# EAGLE design chuck_rev_2 (EAGLE 6.3)
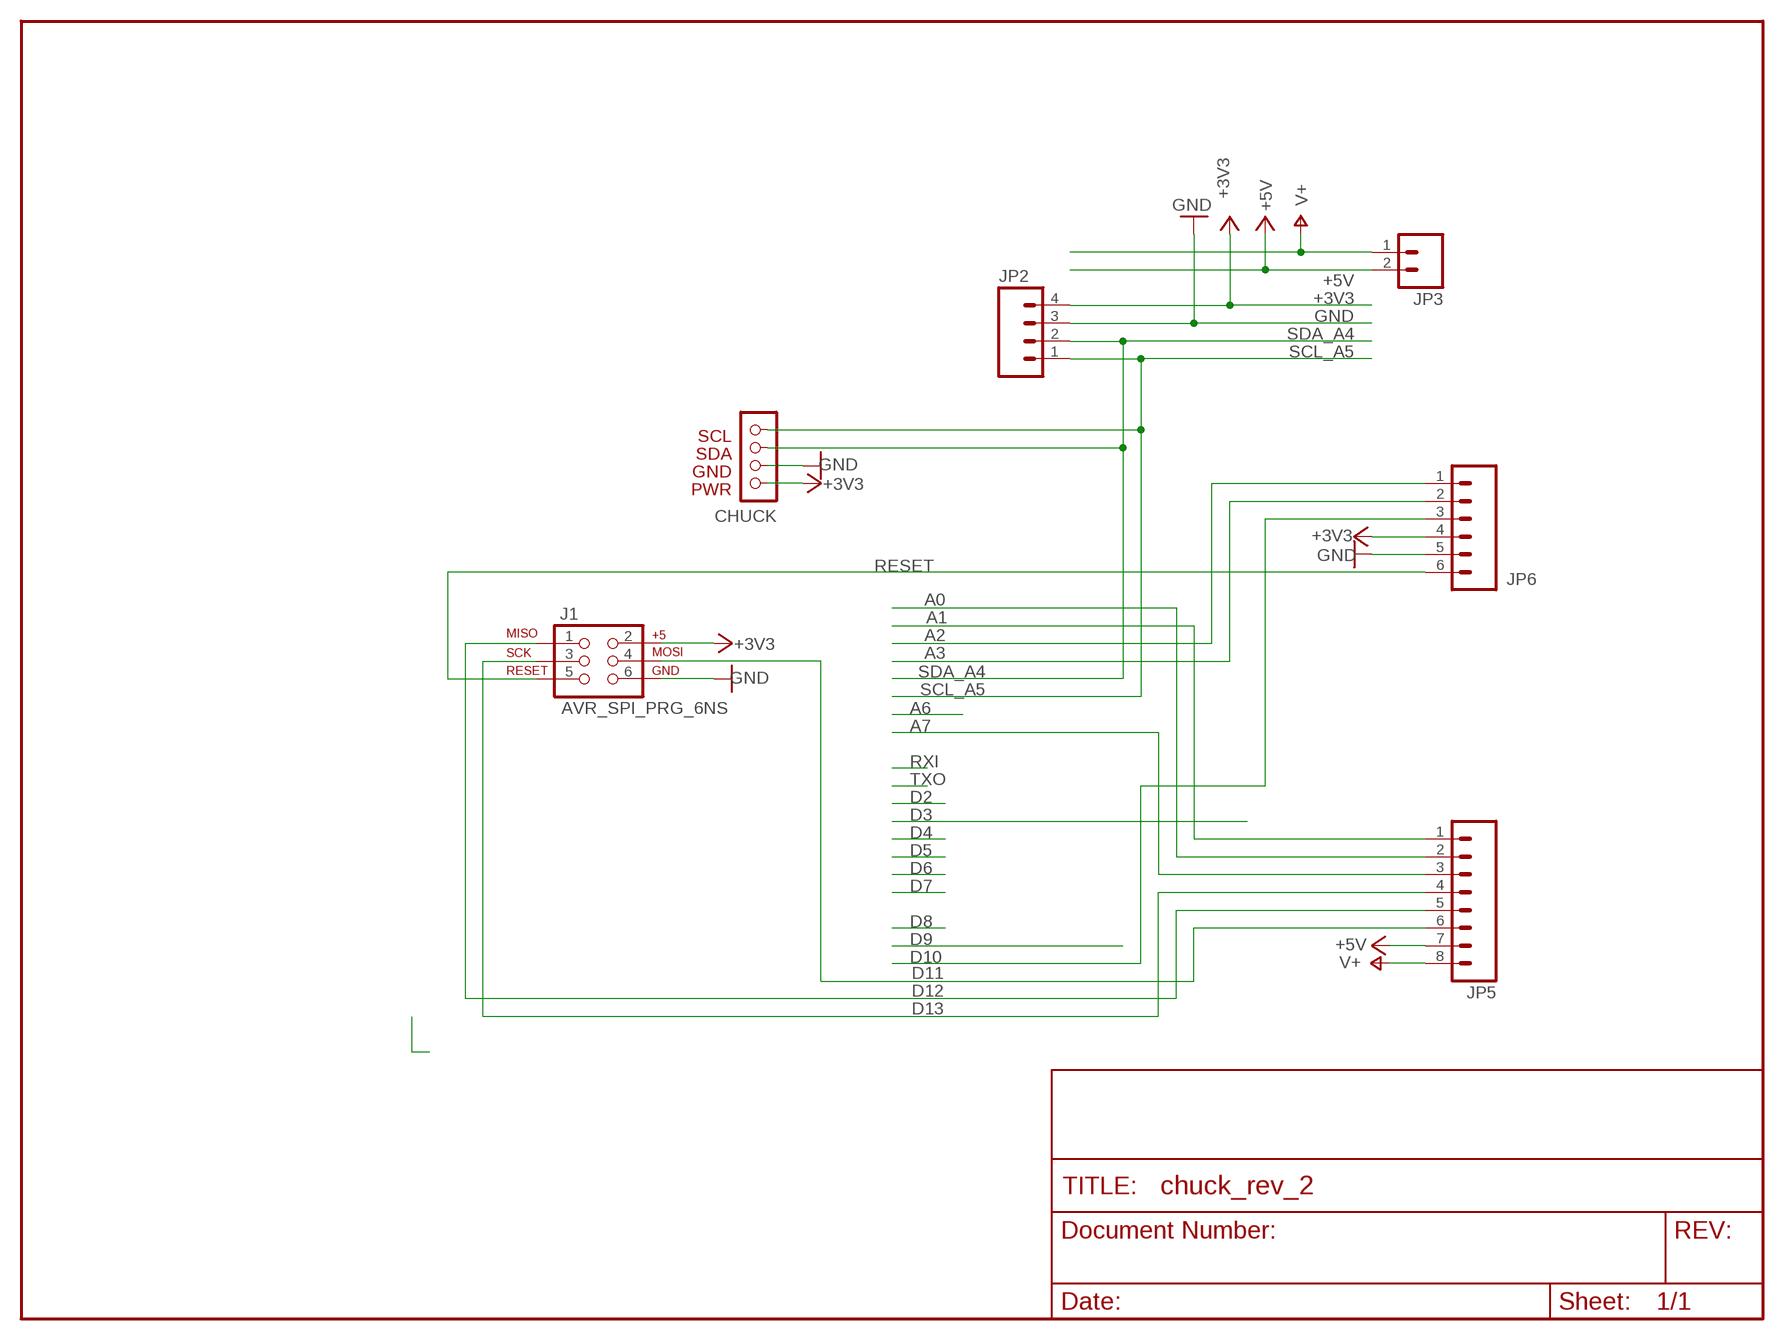
[diagram p0: schematic, sheet 1]

## Parts
CHUCK  NUNCHUCK  [CONN]
J1  AVR_SPI_PRG_6NS  [2X3-NS]
JP2  M04PTH  [1X04]
JP3  M02PTH  [1X02]
JP5  M081X08  [1X08]
JP6  M06SIP  [1X06]

## Nets
+3V3: CHUCK.PWR J1.2 JP2.4 JP6.4
+5V: JP3.2 JP5.7
A0: JP5.2
A1: JP5.1
A2: JP6.1
A3: JP6.2
A7: JP5.3
D10: JP6.3
D11: J1.4 JP5.6
D12: J1.1 JP5.5
D13: J1.3 JP5.4
GND: CHUCK.GND J1.6 JP2.3 JP6.5
RESET: J1.5 JP6.6
SCL_A5: CHUCK.SCL JP2.1
SDA_A4: CHUCK.SDA JP2.2
V+: JP3.1 JP5.8

## Library data of the parts
CHUCK = _my-parts:NUNCHUCK
J1 = SparkFun:AVR_SPI_PRG_6: AVR ISP 6 Pin This is the reduced ISP connector for AVR programming. Common on Arduino. This footprint will take up less PCB space and can be used with a 10-pin to 6-pin adapter such as SKU: BOB-08508
JP2 = SparkFun_mod:M04: Header 4 Standard 4-pin 0.1" header. Use with straight break away headers (SKU : PRT-00116), right angle break away headers (PRT-00553), swiss pins (PRT-00743), machine pins (PRT-00117), and female headers (PRT-00115). Molex polarized connector foot print use with SKU : PRT-08231 with associated crimp pins and housings. 1MM SMD Version SKU: PRT-10208
JP3 = SparkFun_mod:M02: Header 2 Standard 2-pin 0.1" header. Use with straight break away headers (SKU : PRT-00116), right angle break away headers (PRT-00553), swiss pins (PRT-00743), machine pins (PRT-00117), and female headers (PRT-00115). Molex polarized connector foot print use with SKU : PRT-08233 with associated crimp pins and housings.
JP5 = SparkFun_mod:M08: Header 8 Standard 8-pin 0.1" header. Use with straight break away headers (SKU : PRT-00116), right angle break away headers (PRT-00553), swiss pins (PRT-00743), machine pins (PRT-00117), and female headers (PRT-00115).
JP6 = SparkFun:M06: Header 6 Standard 6-pin 0.1" header. Use with straight break away headers (SKU : PRT-00116), right angle break away headers (PRT-00553), swiss pins (PRT-00743), machine pins (PRT-00117), and female headers (PRT-00115). Molex polarized connector foot print use with SKU : PRT-08094 with associated crimp pins and housings. NOTES ON THE VARIANTS LOCK and LOCK_LONGPADS... This footprint was designed to help hold the alignment of a through-hole component (i.e. 6-pin header) while soldering it into place. You may notice that each hole has been shifted either up or down by 0.005 of an inch from it's more standard position (which is a perfectly straight line). This slight alteration caused the pins (the squares in the middle) to touch the edges of the holes. Because they are alternating, it causes a "brace" to hold the component in place. 0.005 has proven to be the perfect amount of "off-center" position when using our standard breakaway headers. Although looks a little odd when you look at the bare footprint, once you have a header in there, the alteration is very hard to notice. Also, if you push a header all the way into place, it is covered up entirely on the bottom side. This idea of altering the position of holes to aid alignment will be further integrated into the Sparkfun Library for other footprints. It can help hold any component with 3 or more connection pins.

## Net classes
0 default: width 0.203 mm
1 vcc: width 0.254 mm

## Board
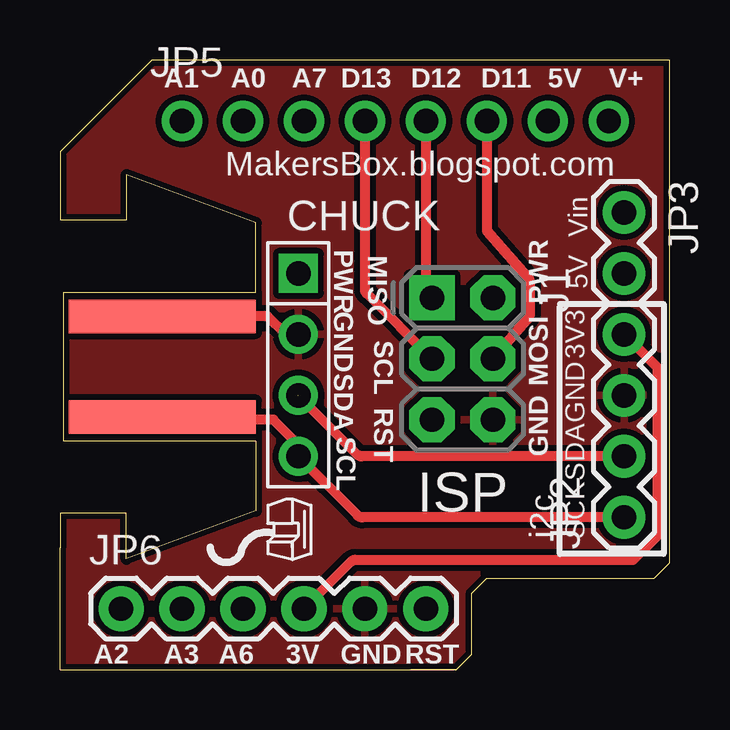
[diagram p1: board, top side]
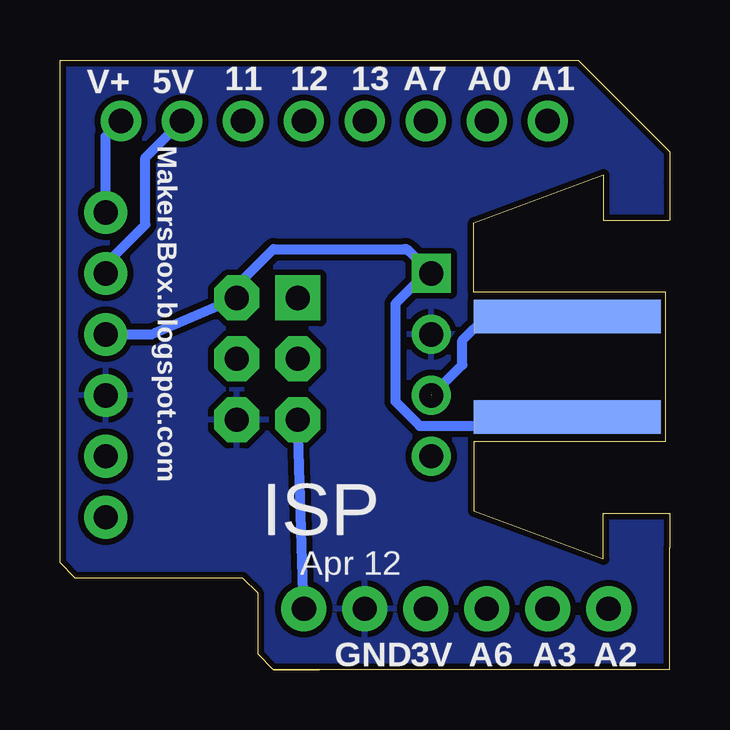
[diagram p2: board, bottom side, seen from below]

Size 25.41 x 25.4 mm. Coordinates in mm from the lower left corner, seen from the top.
Outline: 15.25,0 0.01,0 0.01,5.08
Outline: 16.52,0 15.25,0
Outline: 15.25,0 14.61,0 16.52,0
Outline: 16.52,0 17.15,0.64 17.15,3.17 17.79,3.81 24.77,3.81 25.41,4.45 25.41,21.59 25.41,25.4
Outline: 25.41,25.4 3.82,25.4 0.01,21.59
Outline: 0.01,21.59 0.01,21.59
Outline: 0.01,21.59 0.01,20.32
Copper layers (1*16): Top 0.035mm / dielectric 1.5mm / Bottom 0.035mm
Design rules "SparkFun": minimum track width 8mil, minimum drill 20mil, track to track 8mil, track to pad 8mil, pad to pad 8mil, via to via 8mil, smd to smd 8mil, copper to edge 10mil, drill to drill 8mil, minimum pad ring 12mil, minimum via ring 10mil, stop-mask expansion 4mil, vias tented up to drill 25mil, thermal gap 10mil

### Footprints (pad centres in the part's own frame; a part is rotated, then mirrored left to right if it is on the bottom)
CONN = drill 1.016: GND -0.23,6.35; SCL -0.23,1.27; SDA -0.23,3.81 | smd 7.8 x 1.4 bottom: P$1_SDA -5.9,7.1; P$4_VCC -5.9,2.9 | smd 7.8 x 1.4: P$2_SCL -5.9,2.9; P$3_GND -5.9,7.1 | drill 1.016 square: PWR -0.23,8.89
2X3-NS = drill 1.016 pad 1.88 square: 1 -2.54,-1.27 | drill 1.016 pad 1.88 octagon: 2 -2.54,1.27; 3 0,-1.27; 4 0,1.27; 5 2.54,-1.27; 6 2.54,1.27
1X04 = drill 1.016 pad 1.778: 1 0,0; 2 2.54,0; 3 5.08,0; 4 7.62,0
1X02 = drill 1.016 pad 1.778: 1 0,0; 2 2.54,0
1X08 = drill 1.016 pad 1.676: 1 0,0; 2 2.54,0; 3 5.08,0; 4 7.62,0; 5 10.16,0; 6 12.7,0; 7 15.24,0; 8 17.78,0
1X06 = drill 1.016 pad 1.88: 1 0,0; 2 2.54,0; 3 5.08,0; 4 7.62,0; 5 10.16,0; 6 12.7,0

### Placement (x,y rotation side)
CHUCK  10.17,7.62 0 top
J1  16.77,12.95 270 top
JP2  23.5,6.35 90 top
JP3  23.5,19.05 270 top
JP5  5.09,22.86 0 top
JP6  2.55,2.54 0 top

### Tracks (layer width: path | path; a pad name or v marks a point on that pad's centre or on a via)
+3V3
  Top 0.406: JP2.4 24.9,12.57 24.9,5.59 23.88,4.57 12.3,4.57 arc45 12.12,4.5 JP6.4
  Bottom 0.406: JP2.4 21.6,13.97 J1.2 18.04,15.9 arc45 17.97,16.08 16.52,17.53 11.06,17.53 arc45 10.88,17.45 CHUCK.PWR
+5V
  Bottom 0.406: JP3.2 23.5,16.89 21.85,18.54 21.85,21.34 JP5.7
D11
  Top 0.406: JP5.6 17.79,18.29 19.56,16.26 19.56,14.73 J1.4
D12
  Top 0.406: JP5.5 15.25,15.85 arc45 15.32,15.67 J1.1
D13
  Top 0.406: JP5.4 12.71,15.85 arc45 12.78,15.67 J1.3
GND
  pour Bottom (isolate 0.254): -1.26,26.67 26.68,26.67 26.68,-1.27 -1.26,-1.27
  pour Top (isolate 0.254): -0.63,26.04 26.68,26.04 26.68,0 26.04,-0.64 -0.63,-0.64
RESET
  Bottom 0.406: JP6.6 J1.5
SCL_A5
  Top 0.406: JP2.1 12.58,6.35 arc-45 12.4,6.42 CHUCK.SCL
SDA_A4  (1 unrouted)
  Top 0.406: JP2.2 12.56,8.89 arc-45 12.38,8.96 9.91,11.43
V+
  Bottom 0.406: JP3.1 23.5,22.23 JP5.8

### Text on the board
tPlace: A1 | A0 | A7 | D13 | D12 | D11 | 5V | V+ | MakersBox.blogspot.com | Vin | MISO | 5V | PWR | SCL | 3V3 | MOSI | RST | GND | GND | ISP | SDA | i2c | SCK | A2 | A3 | A6 | 3V | GND | RST
bPlace: A1 | A0 | A7 | 13 | 12 | 5V | V+ | 11 | MakersBox.blogspot.com | ISP | Apr 12 | A2 | A3 | A6 | 3V | GND